# Altium schematic sheet STM32F103RCT6.SchDoc
size A; SheetNumber: 3; SheetTotal: 3
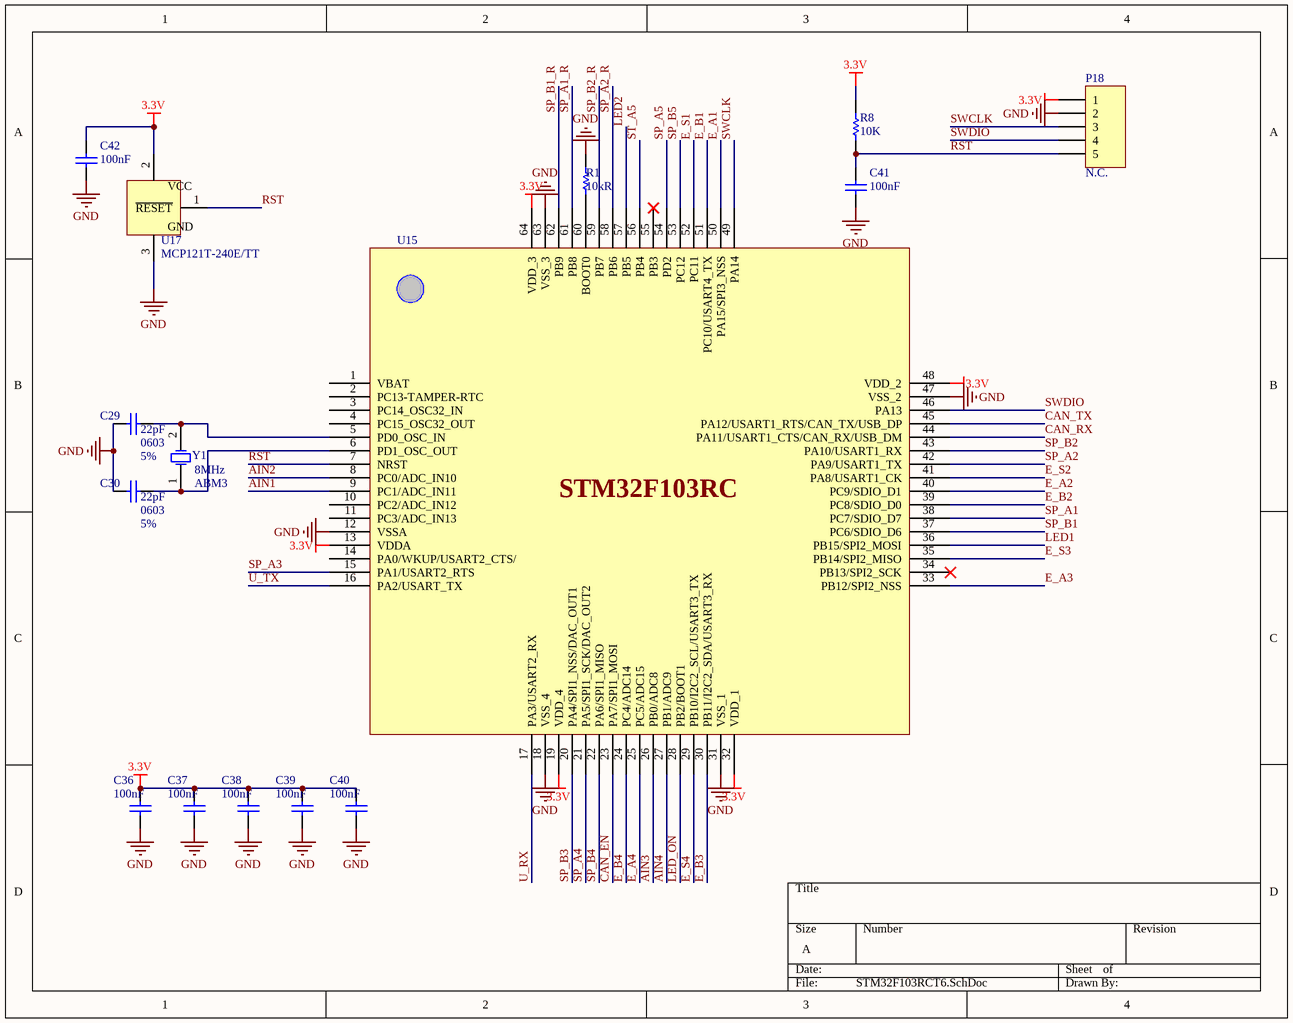
[diagram p0: STM32F103RCT6.SchDoc]

## Parts
C29  value 22pF  Case Code (Imperial): 0603  Tolerance: 5%  [C0603]  (hidden comment: Cap)
C30  value 22pF  Case Code (Imperial): 0603  Tolerance: 5%  [C0603]  (hidden comment: Cap)
C36  100nF  [C0402]
C37  100nF  [C0402]
C38  100nF  [C0402]
C39  100nF  [C0402]
C40  100nF  [C0402]
C41  100nF  [C0402]
C42  100nF  [C0402]
P18  N.C.  [HDR1X5]
R1  10kR  [R0402]
R8  value 10K  [R0402]  (hidden comment: Res1)
U15  STM32F103RC  [LQFP64]
U17  MCP121T-240E/TT  [SOT23-3]
Y1  value 8MHz  [ABM3]  (hidden comment: Crystal Oscillator)

## Nets
3.3V: C36.2 C37.2 C38.2 C39.2 C40.2 C42.2 P18.1 R8.1 U15.13(VDDA) U15.19(VDD_4) U15.32(VDD_1) U15.48(VDD_2) U15.64(VDD_3) U17.2(VCC)
GND: C29.2 C30.2 C36.1 C37.1 C38.1 C39.1 C40.1 C41.1 C42.1 P18.2 R1.2 U15.12(VSSA) U15.18(VSS_4) U15.31(VSS_1) U15.47(VSS_2) U15.63(VSS_3) U17.3(GND)
AIN1: U15.9(PC1/ADC_IN11)
AIN2: U15.8(PC0/ADC_IN10)
AIN3: U15.26(PB0/ADC8)
AIN4: U15.27(PB1/ADC9)
CAN_EN: U15.23(PA7/SPI1_MOSI)
CAN_RX: U15.44(PA11/USART1_CTS/CAN_RX/USB_DM)
CAN_TX: U15.45(PA12/USART1_RTS/CAN_TX/USB_DP)
E_A1: U15.50(PA15/SPI3_NSS)
E_A2: U15.40(PC9/SDIO_D1)
E_A3: U15.33(PB12/SPI2_NSS)
E_A4: U15.25(PC5/ADC15)
E_B1: U15.51(PC10/USART4_TX)
E_B2: U15.39(PC8/SDIO_D0)
E_B3: U15.30(PB11/I2C2_SDA/USART3_RX)
E_B4: U15.24(PC4/ADC14)
E_S1: U15.52(PC11)
E_S2: U15.41(PA8/USART1_CK)
E_S3: U15.35(PB14/SPI2_MISO)
E_S4: U15.29(PB10/I2C2_SCL/USART3_TX)
LED1: U15.36(PB15/SPI2_MOSI)
LED2: U15.57(PB5)
LED_ON: U15.28(PB2/BOOT1)
RST: C41.2 P18.5 R8.2 U15.7(NRST) U17.1(~{RESET})
SP_A1: U15.38(PC7/SDIO_D7)
SP_A1_R: U15.61(PB8)
SP_A2: U15.42(PA9/USART1_TX)
SP_A2_R: U15.58(PB6)
SP_A3: U15.15(PA1/USART2_RTS)
SP_A4: U15.21(PA5/SPI1_SCK/DAC_OUT2)
SP_A5: U15.54(PD2)
SP_B1: U15.37(PC6/SDIO_D6)
SP_B1_R: U15.62(PB9)
SP_B2: U15.43(PA10/USART1_RX)
SP_B2_R: U15.59(PB7)
SP_B3: U15.20(PA4/SPI1_NSS/DAC_OUT1)
SP_B4: U15.22(PA6/SPI1_MISO)
SP_B5: U15.53(PC12)
ST_A5: U15.56(PB4)
SWCLK: P18.3 U15.49(PA14)
SWDIO: P18.4 U15.46(PA13)
U_RX: U15.17(PA3/USART2_RX)
U_TX: U15.16(PA2/USART_TX)
NetC29_1: C29.1 U15.5(PD0_OSC_IN) Y1.2(OSC2)
NetC30_1: C30.1 U15.6(PD1_OSC_OUT) Y1.1(OSC1)
NetR1_1: R1.1 U15.60(BOOT0)

Not connected (* = marked no-connect by the designer): U15 1(VBAT) 2(PC13-TAMPER-RTC) 3(PC14_OSC32_IN) 4(PC15_OSC32_OUT) 10(PC2/ADC_IN12) 11(PC3/ADC_IN13) 14(PA0/WKUP/USART2_CTS/) 34(PB13/SPI2_SCK)* 55(PB3)*

## Library data of the parts
C29 C30 = Cap_0603: CAP CER 22PF 50V C0G/NPO 0603; Manufacturer: Yageo; Manufacturer Part Number: CC0603JRNPO9BN220; Dielectric: C0G; Temperature Coefficient: 30ppm/°C; Insulation Resistance: 10GR; Supplier 1: Digi-Key; Supplier Part Number 1: 311-1062-6-ND; Stock 1: 221499; Pricing 1: 1=0.1, 10=0.044, 100=0.0197, 500=0.0141, 1000=0.01108 (USD); Mount: Surface Mount; Case/Package: 0603; Number of Pins: 2; Case Code (Metric): 1608; Min Operating Temperature: -55°C; Max Operating Temperature: 125°C; Capacitance: 22pF; Voltage Rating: 50V; Voltage Rating (DC): 50V; Packaging: Tape and Reel; Package Quantity: 1; Termination: SMD/SMT; Voltage: 50V; Length: 1.6mm; Height: 0.8mm; Width: 0.031inch; Thickness: 0.035inch; Depth: 0.8mm; Radiation Hardening: No; REACH SVHC: No SVHC; Lead Free: Lead Free; ComponentLink1URL: http://www.farnell.com/datasheets/2213336.pdf?src-supplier=Element14; ComponentLink1Description: http://www.farnell.com/datasheets/2213336.pdf?src-supplier=Element14; ComponentLink2URL: http://www.yageo.com/documents/recent/UPY-GP_NP0_16V-to-50V_16.pdf?src-supplier=Digi-Key; ComponentLink2Description: http://www.yageo.com/documents/recent/UPY-GP_NP0_16V-to-50V_16.pdf?src-supplier=Digi-Key; ComponentLink3URL: http://www.farnell.com/datasheets/1443161.pdf?src-supplier=Element14; ComponentLink3Description: http://www.farnell.com/datasheets/1443161.pdf?src-supplier=Element14; ComponentLink4URL: http://www.yageo.com/documents/recent/UPY-GP_NP0_16V-to-50V_8.pdf?src-supplier=Avnet; ComponentLink4Description: http://www.yageo.com/documents/recent/UPY-GP_NP0_16V-to-50V_8.pdf?src-supplier=Avnet; ComponentLink5URL: http://www.yageo.com/documents/recent/UPY-GP_NP0_16V-to-50V_8.pdf?src-supplier=Avnet+Europe; ComponentLink5Description: http://www.yageo.com/documents/recent/UPY-GP_NP0_16V-to-50V_8.pdf?src-supplier=Avnet+Europe
C36-C42 = Cap: 100nF ±10% 16V X7R 0402 Multilayer Ceramic Capacitors MLCC - SMD/SMT RoHS; Manufacturer: KEMET; Manufacturer Part Number: C0402C104K4RAC-TU; Dissipation Factor: 3.5%; Supplier 1: Digi-Key; Supplier Part Number 1: 399-C0402C104K4RAC7867CT-ND; RoHS: Yes; Category: Ceramic Capacitors; Stock 1: 4665619; Pricing 1: 1=0.1, 10=0.032, 50=0.0172, 100=0.0141, 500=0.01008, 1000=0.00792, 2500=0.0072, 5000=0.00662 (USD); Case/Package: 0402; Number of Pins: 2; Case Code (Metric): 1005; Case Code (Imperial): 0402; Dielectric Material: Ceramic; Min Operating Temperature: -55°C; Max Operating Temperature: 125°C; Capacitance: 100nF; Tolerance: 10%; Voltage Rating: 16V; Packaging: Tape and Reel; Series: C; Dielectric: X7R; Voltage: 16V; Termination: SMD/SMT; Length: 1mm; Height: 0.5mm; Depth: 0.5mm; Reach SVHC Compliant: No
P18 = Header 5: Header, 5-Pin
R1 = Res1: SMD Chip Resistor, 10 kOhm, ± 5%, 63 mW, 0402 [1005 Metric], Thick Film, General Purpose; Manufacturer: Yageo; Manufacturer Part Number: RC0402JR-0710KL; Power Rating: 62.5mW; Voltage Rating: 50V; Temperature Coefficient: 100ppm/°C; Max Power Dissipation: 63mW; ComponentLink1URL: https://datasheet.ciiva.com/7660/38590-7660789.pdf?src-supplier=Element14; ComponentLink1Description: https://datasheet.ciiva.com/7660/38590-7660789.pdf?src-supplier=Element14; ComponentLink2URL: https://datasheet.ciiva.com/46440/1868787-46440891.pdf?src-supplier=Element14; ComponentLink2Description: https://datasheet.ciiva.com/46440/1868787-46440891.pdf?src-supplier=Element14; ComponentLink3URL: https://datasheet.ciiva.com/7746/1738695-7746239.pdf?src-supplier=Element14; ComponentLink3Description: https://datasheet.ciiva.com/7746/1738695-7746239.pdf?src-supplier=Element14; ComponentLink4URL: https://datasheet.ciiva.com/15189/getdatasheetpartid-409289-15189591.pdf?src-supplier=Verical; ComponentLink4Description: https://datasheet.ciiva.com/15189/getdatasheetpartid-409289-15189591.pdf?src-supplier=Verical; Supplier 1: Digi-Key; Supplier Part Number 1: 311-10KJRCT-ND; RoHS: Yes; Category: Chip SMD Resistors; Stock 1: 36550952; Pricing 1: 1=0.1, 10=0.018, 50=0.0098, 100=0.0079, 500=0.00502, 1000=0.00422, 5000=0.00292 (USD); Case/Package: 0402; Case Code (Metric): 1005; Case Code (Imperial): 0402; Size Code: 0402; Min Operating Temperature: -55°C; Max Operating Temperature: 155°C; Packaging: Tape and Reel; Resistance: 10kR; Tolerance: 5%; Package Quantity: 1; Resistor Type: Thick Film; Number of Terminations: 2; Termination: SMD/SMT; Features: Moisture Resistant; Series: RC; Resistance Tolerance: 5%; Voltage Rating (AC): 50V; Construction: Rectangular; Length: 0.039inch; Width: 0.02inch; Height: 0.016inch; Depth: 0.5mm; Lead Free: Lead Free; RoHS Compliant: Yes; Reach SVHC Compliant: Unknown; Military Standard: Not
R8 = Res1: RES SMD 10 KOHM 1% 1/16W 0402; Manufacturer 1: UNI-ROYAL(Uniroyal Elec); Manufacturer Part Number 1: 0402WGF1002TCE; Footprint: 0402; Supplier 1: JLCPCB; Supplier Part Number 1: C25744
U15 = STM32F103RC: MCU 32-bit STM32F1 ARM Cortex M3 RISC 256KB Flash 2.5V/3.3V 64-Pin LQFP Tray; Manufacturer: STMicroelectronics; Manufacturer Part Number: STM32F103RCT6; Interface: I2C,SPI,USB,CAN,USART; RAM Size: 48KB; Max Supply Voltage: 3.6V; Number of I/Os: 51; Number of Timers/Counters: 8; Min Supply Voltage: 2V; Data Bus Width: 32b; Max Frequency: 72MHz; Number of ADC Channels: 16; Supplier 1: LCSC; Supplier Part Number 1: C8323; RoHS: Yes; Category: Microcontrollers; Stock 1: 874; Pricing 1: 1=2.3912, 10=2.0905, 30=1.8789, 100=1.6848, 500=1.5957, 1000=1.5607 (USD); Case/Package: LQFP; Number of Pins: 64; Weight: 0.012088oz; Min Operating Temperature: -40°C; Max Operating Temperature: 85°C; Package Quantity: 960; Packaging: Tray; Memory Type: FLASH; Memory Size: 256KB; Core Architecture: ARM; Series: STM32F103RC; Length: 10mm; Width: 10mm; Height: 1.4mm; Lead Free: Lead Free; RoHS Compliant: Yes; ComponentLink1URL: https://datasheet.ciiva.com/4845/cd00191185-4845648.pdf?src-supplier=Mouser; ComponentLink1Description: https://datasheet.ciiva.com/4845/cd00191185-4845648.pdf?src-supplier=Mouser; ComponentLink2URL: https://datasheet.ciiva.com/8054/1831497-8054949.pdf?src-supplier=Element14; ComponentLink2Description: https://datasheet.ciiva.com/8054/1831497-8054949.pdf?src-supplier=Element14; ComponentLink3URL: https://datasheet.ciiva.com/5752/cd00191185-5752853.pdf?src-supplier=Farnell; ComponentLink3Description: https://datasheet.ciiva.com/5752/cd00191185-5752853.pdf?src-supplier=Farnell; ComponentLink4URL: https://datasheet.ciiva.com/9224/cd00191185-9224408.pdf?src-supplier=Avnet; ComponentLink4Description: https://datasheet.ciiva.com/9224/cd00191185-9224408.pdf?src-supplier=Avnet; ComponentLink5URL: https://datasheet.ciiva.com/16382/cd00191185-16382444.pdf?src-supplier=Future+Electronics; ComponentLink5Description: https://datasheet.ciiva.com/16382/cd00191185-16382444.pdf?src-supplier=Future+Electronics
U17 = MCP121: IC SUPERVISOR 1 CHANNEL SOT23-3; Manufacturer: Microchip; Min Supply Voltage: 1V; Max Supply Voltage: 5.5V; Nominal Supply Current: 20uA; Number of Voltages Monitored: 1; Reset: Active Low; Reset Timeout: 80ms; Threshold Voltage: 2.32V; Overvoltage Threshold: 2.355V; Undervoltage Threshold: 2.285V; Watchdog Timer: No; Quiescent Current: 1uA; Supplier 1: Digi-Key; Supplier Part Number 1: MCP121T-240E/TTCT-ND; Manufacturer Part Number: MCP121T-240E/TT; Stock 1: 2743; Pricing 1: 1=0.53, 25=0.45, 100=0.4 (USD); Mount: Surface Mount; Case/Package: SOT-23-3; Number of Pins: 3; Min Operating Temperature: -40°C; Max Operating Temperature: 125°C; Packaging: Tape and Reel; Type: Simple Reset/Power-On Reset; Package Quantity: 1; Operating Supply Current: 20uA; Max Supply Current: 20uA; Number of Elements: 1; Min Reset Threshold Voltage: 2.285V; Max Reset Threshold Voltage: 2.355V; Length: 3.04mm; Height: 1.02mm; Width: 1.4mm; Radiation Hardening: No; REACH SVHC: No SVHC; Lead Free: Lead Free; ComponentLink1URL: http://www.microchip.com/mymicrochip/filehandler.aspx?ddocname=en023833&src-supplier=Digi-Key; ComponentLink1Description: http://www.microchip.com/mymicrochip/filehandler.aspx?ddocname=en023833&src-supplier=Digi-Key; ComponentLink2URL: http://www.microchip.com/mymicrochip/filehandler.aspx?ddocname=en022913&src-supplier=Digi-Key; ComponentLink2Description: http://www.microchip.com/mymicrochip/filehandler.aspx?ddocname=en022913&src-supplier=Digi-Key; ComponentLink3URL: http://ww1.microchip.com/downloads/jp/DeviceDoc/21906b.pdf?src-supplier=Avnet; ComponentLink3Description: http://ww1.microchip.com/downloads/jp/DeviceDoc/21906b.pdf?src-supplier=Avnet; ComponentLink4URL: http://www.microchip.com/mymicrochip/filehandler.aspx?ddocname=en022913&src-supplier=Future+Electronics; ComponentLink4Description: http://www.microchip.com/mymicrochip/filehandler.aspx?ddocname=en022913&src-supplier=Future+Electronics; ComponentLink5URL: http://ww1.microchip.com/downloads/jp/DeviceDoc/21906b.pdf?src-supplier=Avnet+Europe; ComponentLink5Description: http://ww1.microchip.com/downloads/jp/DeviceDoc/21906b.pdf?src-supplier=Avnet+Europe; ComponentLink6URL: http://www.farnell.com/datasheets/1787125.pdf?src-supplier=Element14; ComponentLink6Description: http://www.farnell.com/datasheets/1787125.pdf?src-supplier=Element14; ComponentLink7URL: http://www.produktinfo.conrad.com/datenblaetter/1000000-1099999/001085773-da-01-en-IC_SUPERVISO_MCP121T_240E_TT_SOT_23B_MCP.pdf?src-supplier=Conrad; ComponentLink7Description: http://www.produktinfo.conrad.com/datenblaetter/1000000-1099999/001085773-da-01-en-IC_SUPERVISO_MCP121T_240E_TT_SOT_23B_MCP.pdf?src-supplier=Conrad
Y1 = XTAL: CRYSTAL 8.0000MHZ 12PF SMD; Manufacturer: Kyocera AVX; Manufacturer Part Number: CX5032GB08000H0HPQZ1; ESR (Equivalent Series Resistance): 300R; Frequency Stability: 30ppm; Frequency Tolerance: 20ppm; Supplier 1: Digi-Key; Supplier Part Number 1: 1253-1373-6-ND; Stock 1: 10035; Pricing 1: 1=0.8, 10=0.708, 50=0.6622, 100=0.5852, 500=0.5544 (USD); Mount: Surface Mount; Case/Package: ABM3; Weight: 0.001764oz; Min Operating Temperature: -40°C; Max Operating Temperature: 85°C; Packaging: Tape and Reel; Frequency: 8MHz; Load Capacitance: 12pF; Termination: SMD/SMT; Tolerance: 20ppm; Package Quantity: 1000; Length: 0.197inch; Height: 0.043inch; Width: 0.126inch; ComponentLink1URL: https://media.digikey.com/pdf/Data%20Sheets/AVX%20PDFs/CX5032GB0yyyyyH0HPQZ1_Series_Spec.pdf?src-supplier=Digi-Key; ComponentLink1Description: https://media.digikey.com/pdf/Data%20Sheets/AVX%20PDFs/CX5032GB0yyyyyH0HPQZ1_Series_Spec.pdf?src-supplier=Digi-Key; ComponentLink2URL: http://www.kyocera-crystal.jp/eng/wp-content/uploads/2015/10/cx5032gb_e.pdf?src-supplier=Avnet+Asia; ComponentLink2Description: http://www.kyocera-crystal.jp/eng/wp-content/uploads/2015/10/cx5032gb_e.pdf?src-supplier=Avnet+Asia; ComponentLink3URL: http://www.mouser.com/ds/2/40/cx5032gb_e-934943.pdf?src-supplier=Mouser; ComponentLink3Description: http://www.mouser.com/ds/2/40/cx5032gb_e-934943.pdf?src-supplier=Mouser